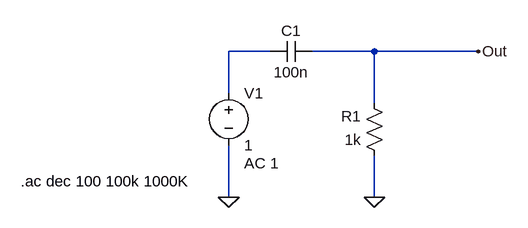
[diagram p0: schematic HighPassFilter_RC.asc]
HighPassFilter_RC.asc, the LTspice schematic file:
Version 4.1
SHEET 1 880 680
WIRE -32 144 -96 144
WIRE 128 144 32 144
WIRE 288 144 128 144
WIRE -96 208 -96 144
WIRE 128 224 128 144
WIRE -96 368 -96 288
WIRE 128 368 128 304
FLAG -96 368 0
FLAG 288 144 Out
FLAG 128 368 0
SYMBOL res 144 320 R180
WINDOW 0 36 76 Left 2
WINDOW 3 36 40 Left 2
SYMATTR InstName R1
SYMATTR Value 1k
SYMBOL voltage -96 192 R0
WINDOW 123 24 124 Left 2
WINDOW 39 0 0 Left 0
SYMATTR InstName V1
SYMATTR Value 1
SYMATTR Value2 AC 1
SYMBOL cap 32 128 R90
WINDOW 0 0 32 VBottom 2
WINDOW 3 32 32 VTop 2
SYMATTR InstName C1
SYMATTR Value 100n
TEXT -416 344 Left 2 !.ac dec 100 100k 1000K

The netlist it stands for:
* HighPassFilter_RC.asc
R1 0 Out 1k
V1 N001 0 1 AC 1
C1 Out N001 100n
.ac dec 100 100k 1000K
.backanno
.end

* Results of the author's LTspice run, read from the files saved beside the schematic
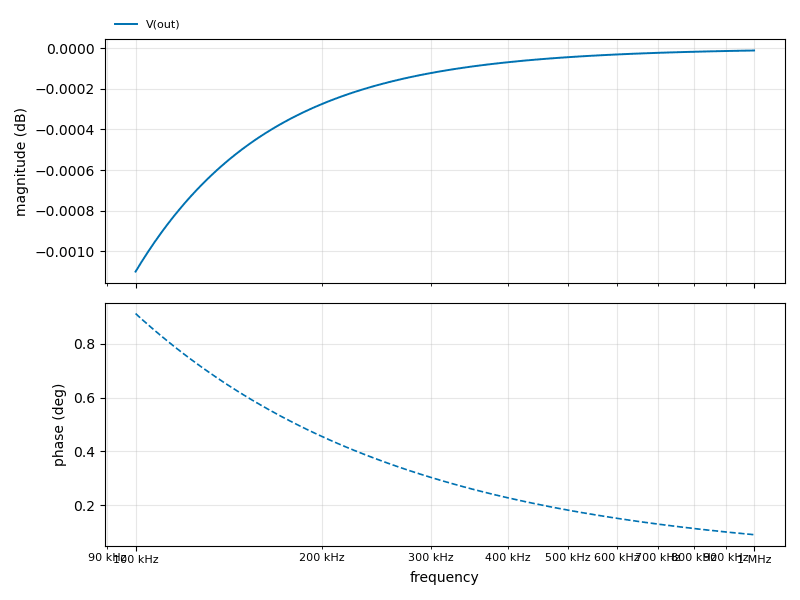
[diagram p1: AC Analysis of HighPassFilter_RC.asc, plotted from the saved traces]
* AC Analysis, 1 run:
*   V(out): -0.00 dB at 100 kHz, -0.00 dB at 1 MHz, peak -0.00 dB at 1 MHz